# EAGLE board FPGA_ADC_USB_Board (EAGLE 6.5.0)
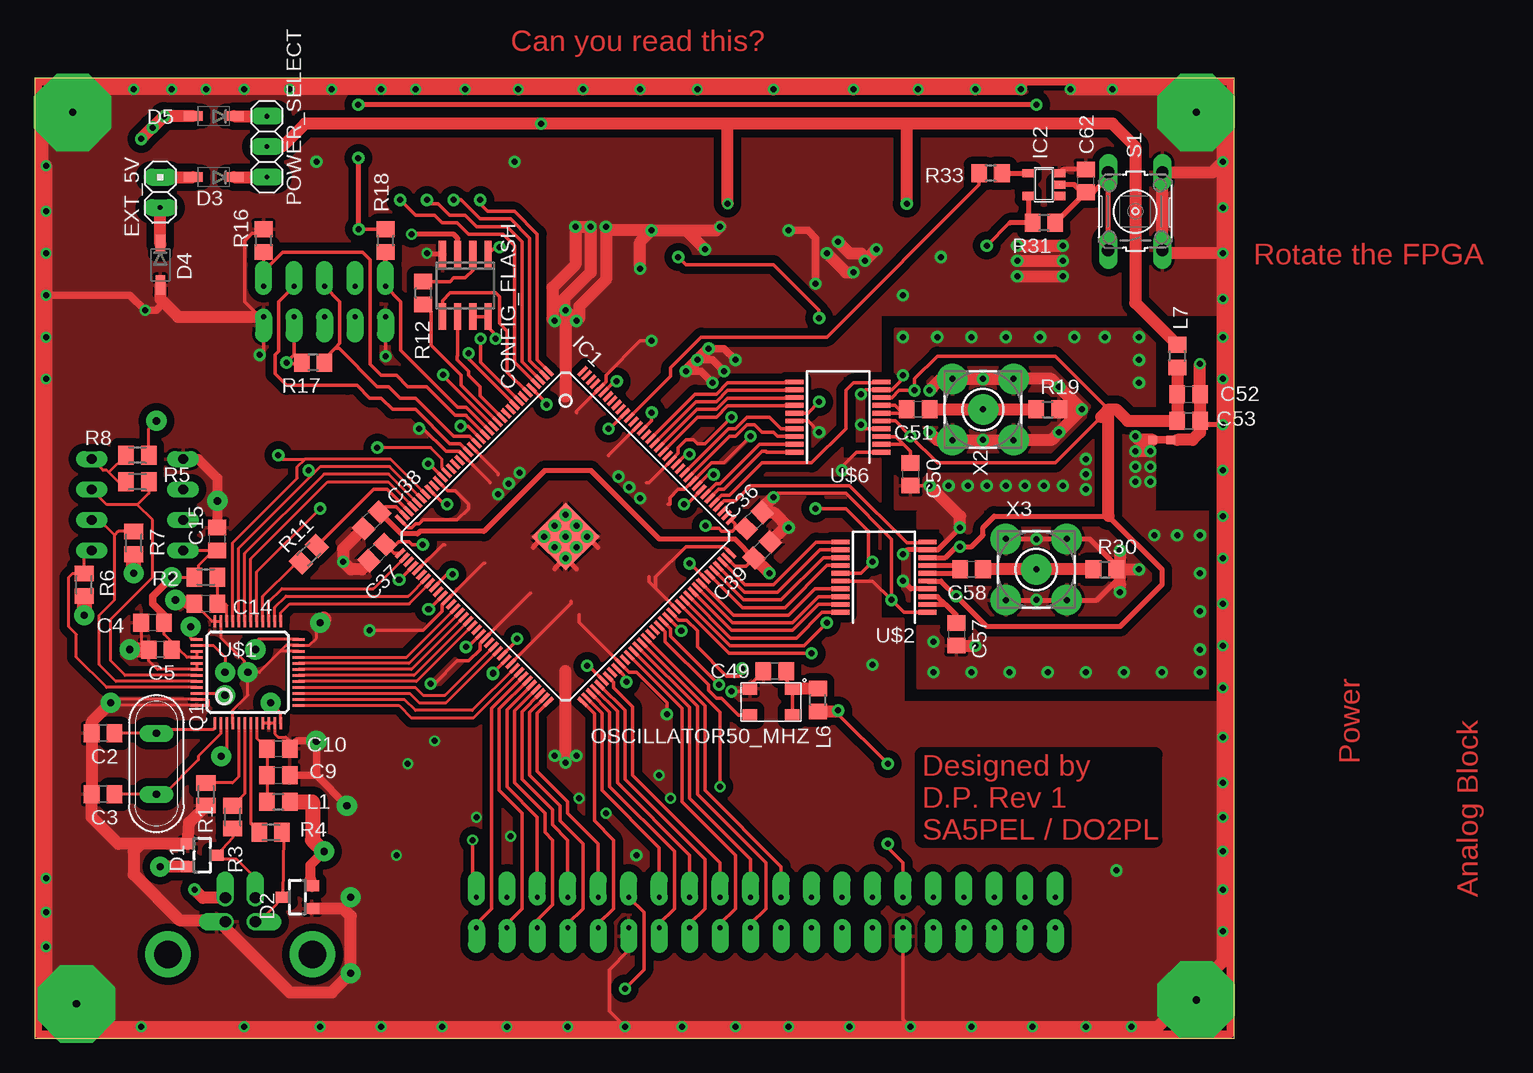
[diagram p5: board, top side]
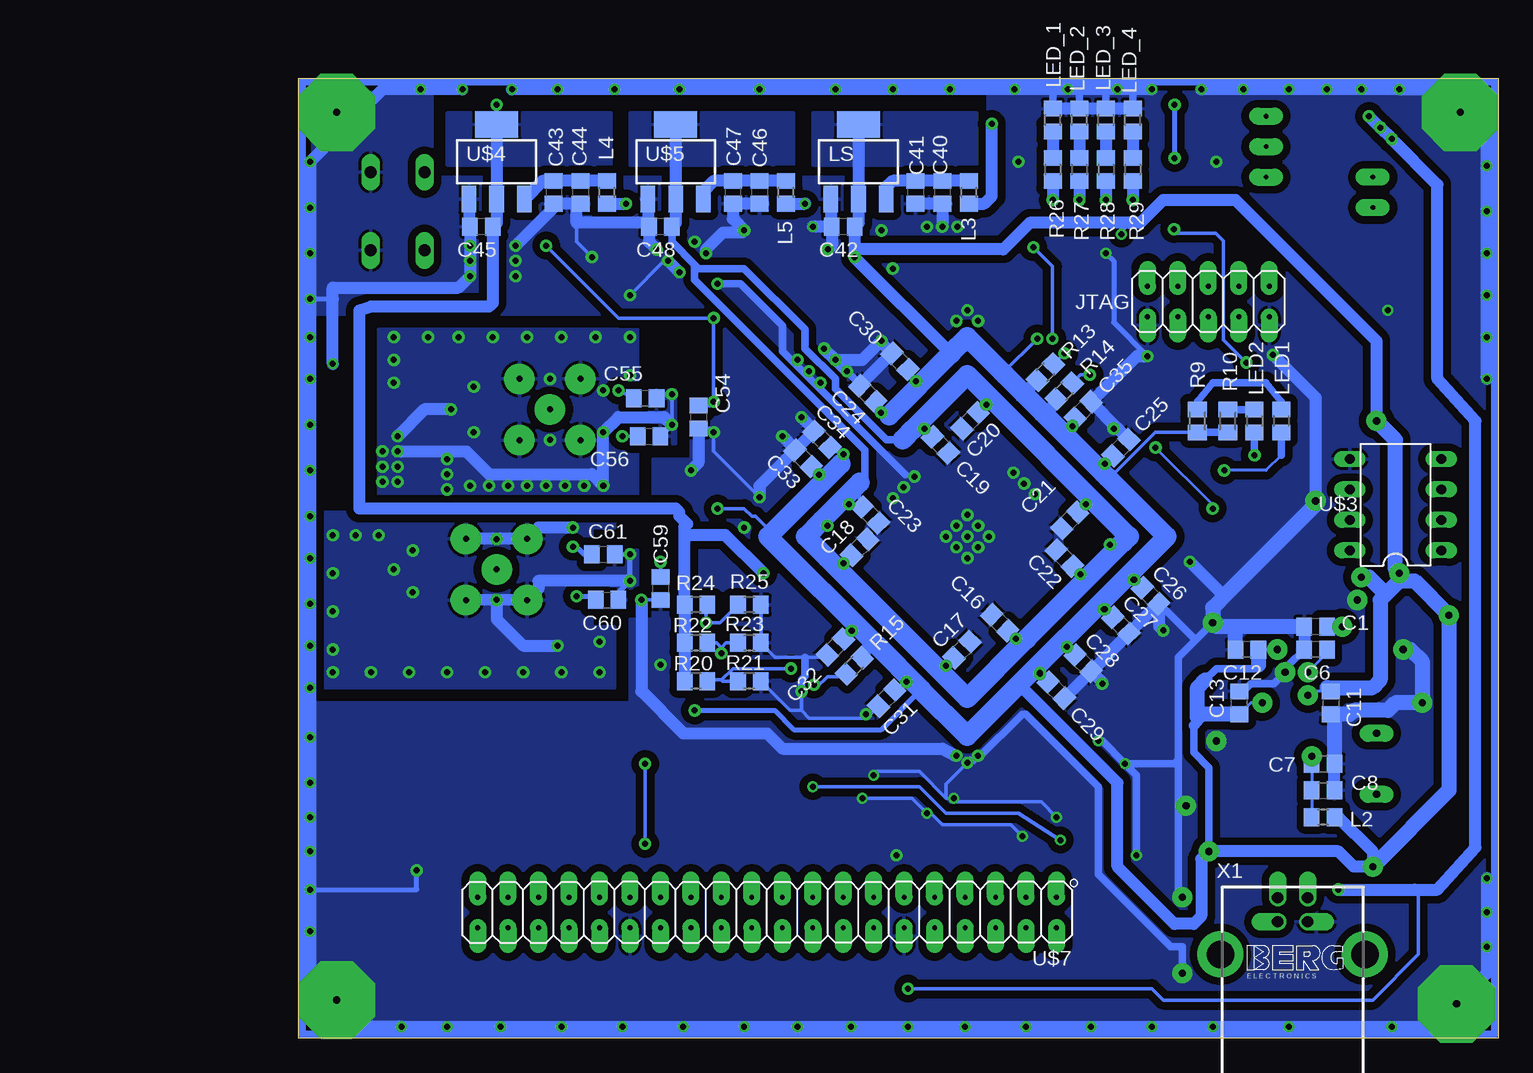
[diagram p6: board, bottom side, seen from below]

Size 100 x 80 mm. Coordinates in mm from the lower left corner, seen from the top.
Outline: 0,0 100,0 100,80 0,80 0,0
Copper layers (1*16): Top 0.035mm / dielectric 1.5mm / Bottom 0.035mm
Design rules "FinalizeAreaFill": minimum track width 12mil, minimum drill 1.4mm, track to track 25mil, track to pad 25mil, pad to pad 8mil, via to via 8mil, smd to smd 8mil, copper to edge 40mil, drill to drill 8mil, minimum pad ring 10mil, minimum via ring 8mil, stop-mask expansion 4mil, vias tented up to drill 0mil, thermal gap 10mil

## Footprints (pad centres in the part's own frame; a part is rotated, then mirrored left to right if it is on the bottom)
C0805 = smd 1.3 x 1.5: 1 -0.95,0; 2 0.95,0
SO08 = smd 0.6 x 2.2: 1 -1.905,-2.6; 2 -0.635,-2.6; 3 0.635,-2.6; 4 1.905,-2.6; 5 1.905,2.6; 6 0.635,2.6; 7 -0.635,2.6; 8 -1.905,2.6
SOT23 = smd 0.9 x 1.2: 1 -0.95,-1.2; 2 0.95,-1.2; 3 0,1.2
SOD123 = smd 1.6 x 0.8: 1 -1.7,0; 2 1.7,0
1X02 = drill 0.4 pad 1.422 long: 1 -1.27,0; 2 1.27,0
EQFP144 = smd 1 x 0.3: 1 -10.75,8.75; 2 -10.75,8.25; 3 -10.75,7.75; 4 -10.75,7.25; 5 -10.75,6.75; 6 -10.75,6.25; 7 -10.75,5.75; 8 -10.75,5.25; 9 -10.75,4.75; 10 -10.75,4.25; 11 -10.75,3.75; 12 -10.75,3.25; 13 -10.75,2.75; 14 -10.75,2.25; 15 -10.75,1.75; 16 -10.75,1.25; 17 -10.75,0.75; 18 -10.75,0.25; 19 -10.75,-0.25; 20 -10.75,-0.75; 21 -10.75,-1.25; 22 -10.75,-1.75; 23 -10.75,-2.25; 24 -10.75,-2.75; 25 -10.75,-3.25; 26 -10.75,-3.75; 27 -10.75,-4.25; 28 -10.75,-4.75; 29 -10.75,-5.25; 30 -10.75,-5.75; 31 -10.75,-6.25; 32 -10.75,-6.75; 33 -10.75,-7.25; 34 -10.75,-7.75; 35 -10.75,-8.25; 36 -10.75,-8.75; 73 10.75,-8.75; 74 10.75,-8.25; 75 10.75,-7.75; 76 10.75,-7.25; 77 10.75,-6.75; 78 10.75,-6.25; 79 10.75,-5.75; 80 10.75,-5.25; 81 10.75,-4.75; 82 10.75,-4.25; 83 10.75,-3.75; 84 10.75,-3.25; 85 10.75,-2.75; 86 10.75,-2.25; 87 10.75,-1.75; 88 10.75,-1.25; 89 10.75,-0.75; 90 10.75,-0.25; 91 10.75,0.25; 92 10.75,0.75; 93 10.75,1.25; 94 10.75,1.75; 95 10.75,2.25; 96 10.75,2.75; 97 10.75,3.25; 98 10.75,3.75; 99 10.75,4.25; 100 10.75,4.75; 101 10.75,5.25; 102 10.75,5.75; 103 10.75,6.25; 104 10.75,6.75; 105 10.75,7.25; 106 10.75,7.75; 107 10.75,8.25; 108 10.75,8.75 | smd 0.3 x 1: 37 -8.75,-10.75; 38 -8.25,-10.75; 39 -7.75,-10.75; 40 -7.25,-10.75; 41 -6.75,-10.75; 42 -6.25,-10.75; 43 -5.75,-10.75; 44 -5.25,-10.75; 45 -4.75,-10.75; 46 -4.25,-10.75; 47 -3.75,-10.75; 48 -3.25,-10.75; 49 -2.75,-10.75; 50 -2.25,-10.75; 51 -1.75,-10.75; 52 -1.25,-10.75; 53 -0.75,-10.75; 54 -0.25,-10.75; 55 0.25,-10.75; 56 0.75,-10.75; 57 1.25,-10.75; 58 1.75,-10.75; 59 2.25,-10.75; 60 2.75,-10.75; 61 3.25,-10.75; 62 3.75,-10.75; 63 4.25,-10.75; 64 4.75,-10.75; 65 5.25,-10.75; 66 5.75,-10.75; 67 6.25,-10.75; 68 6.75,-10.75; 69 7.25,-10.75; 70 7.75,-10.75; 71 8.25,-10.75; 72 8.75,-10.75; 109 8.75,10.75; 110 8.25,10.75; 111 7.75,10.75; 112 7.25,10.75; 113 6.75,10.75; 114 6.25,10.75; 115 5.75,10.75; 116 5.25,10.75; 117 4.75,10.75; 118 4.25,10.75; 119 3.75,10.75; 120 3.25,10.75; 121 2.75,10.75; 122 2.25,10.75; 123 1.75,10.75; 124 1.25,10.75; 125 0.75,10.75; 126 0.25,10.75; 127 -0.25,10.75; 128 -0.75,10.75; 129 -1.25,10.75; 130 -1.75,10.75; 131 -2.25,10.75; 132 -2.75,10.75; 133 -3.25,10.75; 134 -3.75,10.75; 135 -4.25,10.75; 136 -4.75,10.75; 137 -5.25,10.75; 138 -5.75,10.75; 139 -6.25,10.75; 140 -6.75,10.75; 141 -7.25,10.75; 142 -7.75,10.75; 143 -8.25,10.75; 144 -8.75,10.75 | smd 4 x 4: E 0,0
SOT23-5 = smd 0.69 x 0.99: 1 -0.95,-1.29; 2 0,-1.29; 3 0.95,-1.29; 4 0.95,1.3; 5 -0.95,1.3
2X05 = drill 0.4 pad 1.422 offset: 1 -5.08,-1.27; 2 -5.08,1.27; 3 -2.54,-1.27; 4 -2.54,1.27; 5 0,-1.27; 6 0,1.27; 7 2.54,-1.27; 8 2.54,1.27; 9 5.08,-1.27; 10 5.08,1.27
R0805 = smd 1.3 x 1.5: 1 -0.95,0; 2 0.95,0
SOT223 = smd 1.219 x 2.235: 1 -2.311,-3.099; 2 0,-3.099; 3 2.311,-3.099 | smd 3.6 x 2.2: 4 0,3.099
OSZI_5X3.2 = smd 1.2 x 1: 1 -1.77,-1.1; 2 1.77,-1.1; 3 1.77,1.1; 4 -1.77,1.1
1X03 = drill 0.4 pad 1.422 long: 1 -2.54,0; 2 0,0; 3 2.54,0
QS = drill 0.61 pad 1.422 long: 1 -2.54,0; 2 2.54,0
M0805 = smd 1.3 x 1.6: 1 -0.95,0; 2 0.95,0
B3F-10XX = drill 1.016 long: 1 -3.251,2.261; 2 3.251,2.261; 3 -3.251,-2.261; 4 3.251,-2.261
LQFP48 = smd 0.2 x 1: 1 -2.75,-4.25; 2 -2.25,-4.25; 3 -1.75,-4.25; 4 -1.25,-4.25; 5 -0.75,-4.25; 6 -0.25,-4.25; 7 0.25,-4.25; 8 0.75,-4.25; 9 1.25,-4.25; 10 1.75,-4.25; 11 2.25,-4.25; 12 2.75,-4.25; 25 2.75,4.25; 26 2.25,4.25; 27 1.75,4.25; 28 1.25,4.25; 29 0.75,4.25; 30 0.25,4.25; 31 -0.25,4.25; 32 -0.75,4.25; 33 -1.25,4.25; 34 -1.75,4.25; 35 -2.25,4.25; 36 -2.75,4.25 | smd 1 x 0.2: 13 4.25,-2.75; 14 4.25,-2.25; 15 4.25,-1.75; 16 4.25,-1.25; 17 4.25,-0.75; 18 4.25,-0.25; 19 4.25,0.25; 20 4.25,0.75; 21 4.25,1.25; 22 4.25,1.75; 23 4.25,2.25; 24 4.25,2.75; 37 -4.25,2.75; 38 -4.25,2.25; 39 -4.25,1.75; 40 -4.25,1.25; 41 -4.25,0.75; 42 -4.25,0.25; 43 -4.25,-0.25; 44 -4.25,-0.75; 45 -4.25,-1.25; 46 -4.25,-1.75; 47 -4.25,-2.25; 48 -4.25,-2.75
SSOP20 = smd 0.4 x 1.5: 1 -2.925,-3.625; 2 -2.275,-3.625; 3 -1.625,-3.625; 4 -0.975,-3.625; 5 -0.325,-3.625; 6 0.325,-3.625; 7 0.975,-3.625; 8 1.625,-3.625; 9 2.275,-3.625; 10 2.925,-3.625; 11 2.925,3.625; 12 2.275,3.625; 13 1.625,3.625; 14 0.975,3.625; 15 0.325,3.625; 16 -0.325,3.625; 17 -0.975,3.625; 18 -1.625,3.625; 19 -2.275,3.625; 20 -2.925,3.625
DIL-08 = drill 0.813 long: 1 -3.81,-3.81; 2 -1.27,-3.81; 3 1.27,-3.81; 4 3.81,-3.81; 5 3.81,3.81; 6 1.27,3.81; 7 -1.27,3.81; 8 -3.81,3.81
2X20 = drill 0.4 pad 1.422 offset: 1 -24.13,-1.27; 2 -24.13,1.27; 3 -21.59,-1.27; 4 -21.59,1.27; 5 -19.05,-1.27; 6 -19.05,1.27; 7 -16.51,-1.27; 8 -16.51,1.27; 9 -13.97,-1.27; 10 -13.97,1.27; 11 -11.43,-1.27; 12 -11.43,1.27; 13 -8.89,-1.27; 14 -8.89,1.27; 15 -6.35,-1.27; 16 -6.35,1.27; 17 -3.81,-1.27; 18 -3.81,1.27; 19 -1.27,-1.27; 20 -1.27,1.27; 21 1.27,-1.27; 22 1.27,1.27; 23 3.81,-1.27; 24 3.81,1.27; 25 6.35,-1.27; 26 6.35,1.27; 27 8.89,-1.27; 28 8.89,1.27; 29 11.43,-1.27; 30 11.43,1.27; 31 13.97,-1.27; 32 13.97,1.27; 33 16.51,-1.27; 34 16.51,1.27; 35 19.05,-1.27; 36 19.05,1.27; 37 21.59,-1.27; 38 21.59,1.27; 39 24.13,-1.27; 40 24.13,1.27
NET-TIE = smd 0.711 x 0.711: NET1 -0.77,0; NET2 0.73,0
PN61729-S = drill 0.95 offset: 1 1.25,4.71; 2 -1.25,4.71; 3 -1.25,2.71; 4 1.25,2.71 | drill 2.3 pad 3.81: S1 -6.02,0; S2 6.02,0
BU-SMA-V = drill 0.5 pad 2.54: 1 0,0; 2 -2.55,2.55; 3 2.55,2.55; 4 2.55,-2.55; 5 -2.55,-2.55

## Placement (x,y rotation side)
C1  0.1u  [C0805]  15.24,34.29 180 bottom
C2  27p  [C0805]  5.71,25.4 180 top
C3  27p  [C0805]  5.71,20.32 180 top
C4  47u  [C0805]  9.84,34.61 180 top
C5  0.1u  [C0805]  10.48,32.38 180 top
C6  0.1  [C0805]  15.24,32.38 180 bottom
C7  0.1u  [C0805]  14.61,22.86 0 bottom
C8  47u  [C0805]  14.61,20.64 0 bottom
C9  0.1u  [C0805]  20.32,21.91 0 top
C10  47u  [C0805]  20.32,24.13 0 top
C11  0.1u  [C0805]  13.97,27.94 270 bottom
C12  0.1u  [C0805]  20.95,32.38 180 bottom
C13  0.1u  [C0805]  21.59,27.94 90 bottom
C14  10n  [C0805]  14.29,36.2 180 top
C15  0.1  [C0805]  15.24,41.59 90 top
C16  100n  [C0805]  41.57,34.62 135 bottom
C17  100n  [C0805]  44.71,32.37 45 bottom
C18  100n  [C0805]  53.24,40.9 45 bottom
C19  100n  [C0805]  46.51,49.43 315 bottom
C20  100n  [C0805]  44.04,51.45 225 bottom
C21  100n  [C0805]  35.73,43.15 225 bottom
C22  100n  [C0805]  36.18,40.01 135 bottom
C23  100n  [C0805]  52.35,43.6 315 bottom
C24  100n  [C0805]  52.57,53.7 135 bottom
C25  100n  [C0805]  31.47,49.21 45 bottom
C26  100n  [C0805]  29,36.86 315 bottom
C27  100n  [C0805]  31.47,34.39 315 bottom
C28  100n  [C0805]  34.61,31.25 315 bottom
C29  100n  [C0805]  36.86,29 315 bottom
C30  100n  [C0805]  49.88,56.39 135 bottom
C31  100n  [C0805]  51,28.33 225 bottom
C32  100n  [C0805]  55.26,32.6 225 bottom
C33  100n  [C0805]  57.96,48.31 135 bottom
C34  100n  [C0805]  56.39,49.88 135 bottom
C35  100n  [C0805]  34.61,52.35 45 bottom
C36  100n  [C0805]  59.98,43.15 45 top
C37  100n  [C0805]  28.55,40.45 225 top
C38  100n  [C0805]  28.1,43.15 225 top
C39  100n  [C0805]  60.65,40.68 45 top
C40  10u  [C0805]  46.35,70.48 270 bottom
C41  100n  [C0805]  48.58,70.48 270 bottom
C42  10u  [C0805]  54.61,67.63 180 bottom
C43  10u  [C0805]  78.74,70.48 270 bottom
C44  100n  [C0805]  76.52,70.48 270 bottom
C45  10u  [C0805]  84.77,67.63 180 bottom
C46  10u  [C0805]  61.59,70.48 270 bottom
C47  100n  [C0805]  63.82,70.48 270 bottom
C48  10u  [C0805]  69.85,67.63 180 bottom
C49  100n  [C0805]  61.71,30.57 180 top
C50  100nF  [C0805]  73.03,46.99 270 top
C51  100nF  [C0805]  73.66,52.39 180 top
C52  10u  [C0805]  96.2,53.66 0 top
C53  100n  [C0805]  96.2,51.44 0 top
C54  100n  [C0805]  66.67,51.75 270 bottom
C55  100n  [C0805]  71.12,53.34 0 bottom
C56  100n  [C0805]  70.8,50.16 0 bottom
C57  100nF  [C0805]  76.83,33.66 270 top
C58  100nF  [C0805]  78.11,39.05 180 top
C59  100n  [C0805]  69.85,37.47 270 bottom
C60  100n  [C0805]  74.3,36.51 0 bottom
C61  100n  [C0805]  74.61,40.32 0 bottom
C62  1u  [C0805]  87.63,71.44 90 top
CONFIG_FLASH  EPCS-FALSH  [SO08]  35.9,62.73 180 top
D1  [SOT23]  13.97,15.24 270 top
D2  [SOT23]  21.91,11.75 90 top
D3  PMEG2010AEH  [SOD123]  14.92,71.75 180 top
D4  PMEG2010AEH  [SOD123]  10.48,64.45 270 top
D5  PMEG2010AEH  [SOD123]  14.92,76.83 180 top
EXT_5V  [1X02]  10.48,70.48 270 top
IC1  EP3C5E144-V2  [EQFP144]  44.26,41.8 315 top
IC2  74LVC1G07DBV  [SOT23-5]  84.14,71.12 90 top
JTAG  [2X05]  24.18,61.38 180 bottom
L1  600R/0.5A  [R0805]  20.32,19.68 180 top
L2  600R/0.5A  [R0805]  14.61,18.41 180 bottom
L3  MH2029-300Y  [R0805]  44.13,70.48 90 bottom
L4  MH2029-300Y  [R0805]  74.3,70.48 90 bottom
L5  MH2029-300Y  [R0805]  59.37,70.48 90 bottom
L6  MH2029-300Y  [R0805]  65.29,28.17 90 top
L7  MH2029-300Y  [R0805]  95.25,56.83 270 top
LED1  Yellow  [R0805]  18.1,51.44 270 bottom
LED2  Green  [R0805]  20.32,51.44 270 bottom
LED_1  [R0805]  37.15,76.52 90 bottom
LED_2  [R0805]  34.92,76.52 90 bottom
LED_3  [R0805]  32.7,76.52 90 bottom
LED_4  [R0805]  30.48,76.52 90 bottom
LS  3.3V  [SOT223]  53.34,73.03 0 bottom
OSCILLATOR50_MHZ  636L3I050M00000  [OSZI_5X3.2]  61.39,28.03 180 top
POWER_SELECT  [1X03]  19.37,74.3 90 top
Q1  12MHz  [QS]  10.16,22.86 270 top
R1  12k/1%  [M0805]  14.29,20.32 90 top
R2  10k  [M0805]  14.29,38.42 180 top
R3  0  [M0805]  16.51,18.41 270 top
R4  0  [M0805]  19.68,17.14 0 top
R5  2k  [M0805]  8.57,46.35 0 top
R6  10k  [M0805]  4.13,37.78 270 top
R7  10k  [M0805]  8.26,41.27 270 top
R8  10k  [M0805]  8.57,48.58 0 top
R9  470  [M0805]  25.08,51.44 270 bottom
R10  470  [M0805]  22.54,51.44 270 bottom
R11  27  [M0805]  22.86,40.32 45 top
R12  24.9  [R0805]  32.41,62.1 90 top
R13  10k  [R0805]  37.75,55.5 225 bottom
R14  10k  [R0805]  36.18,53.92 225 bottom
R15  10k  [R0805]  53.69,31.02 45 bottom
R16  1k  [R0805]  19.1,66.46 90 top
R17  10k  [R0805]  23.22,56.3 180 top
R18  10k  [R0805]  29.26,66.46 90 top
R19  50Ohm  [R0805]  84.45,52.39 0 top
R20  0  [R0805]  66.88,29.76 180 bottom
R21  0  [R0805]  62.43,29.76 180 bottom
R22  0  [R0805]  66.88,32.93 180 bottom
R23  0  [R0805]  62.43,32.93 180 bottom
R24  0  [R0805]  66.88,36.11 180 bottom
R25  0  [R0805]  62.43,36.11 180 bottom
R26  330  [R0805]  37.15,72.39 270 bottom
R27  330  [R0805]  34.92,72.39 270 bottom
R28  330  [R0805]  32.7,72.39 270 bottom
R29  330  [R0805]  30.48,72.39 270 bottom
R30  50Ohm  [R0805]  89.22,39.05 0 top
R31  100k  [R0805]  84.14,67.94 180 top
R33  120  [R0805]  79.69,72.07 180 top
S1  [B3F-10XX]  91.76,68.9 90 top
U$1  FT232H  [LQFP48]  17.78,30.48 0 top
U$2  AD9057  [SSOP20]  70.8,38.42 90 top
U$3  93LC56  [DIL-08]  8.57,44.45 90 bottom
U$4  2.5V  [SOT223]  83.5,73.03 0 bottom
U$5  1.2V  [SOT223]  68.58,73.03 0 bottom
U$6  AD9057  [SSOP20]  66.99,51.75 90 top
U$7  FPGA_GPIO_DE0  [2X20]  60.96,10.48 180 bottom
U$8  NET_TIE  [NET-TIE]  93.98,49.85 0 top
X1  PN61729-S  [PN61729-S]  17.14,6.99 0 bottom
X2  BU-SMA-V  [BU-SMA-V]  79.06,52.39 90 top
X3  BU-SMA-V  [BU-SMA-V]  83.5,39.05 0 top

## Tracks (layer width: path | path; a pad name or v marks a point on that pad's centre or on a via)
1.2V  (via drill 0.5 pad 1.02)
  Top 0.305: IC1.45 34.4,38.66 v34.84,38.66 | IC1.61 40.22,33.16 v40.22,33.27 | IC1.78 46.2,31.02 v46.06,31.02 | IC1.102 54.64,39.56 v54.59,39.56 | IC1.116 54.38,44.49 v54.14,44.49 | IC1.134 47.94,50.78 v47.86,50.78 | IC1.5 42.69,52.92 v42.69,52.8 | IC1.29 34.15,44.49 v34.39,44.49 | IC1.37 29.96,40.39 C37.1 30.12,41.13 30.34,41.35 31.24,41.35 31.47,41.13 v32.37,41.13 | v55.94,42.7 56.16,42.48 57.06,42.48 57.28,42.25 58.18,42.25 58.41,42.48 | 58.41,42.48 C36.1 | 58.41,42.48 58.41,42.86 IC1.109
  Bottom 0.305: C22.1 v34.84,38.66 v32.37,41.13 32.14,41.35 | C21.1 v34.39,44.49 31.69,41.8 32.14,41.35 | C20.1 v42.69,52.8 42.69,53.7 44.26,55.27 | C19.1 v47.86,50.78 48.75,50.78 | C23.1 53.24,44.49 | 53.24,44.49 v54.14,44.49 | C17.1 v46.06,31.02 46.06,30.13 44.26,28.33 | v55.94,42.7 56.39,43.15 | 53.24,44.49 53.24,46.29 | 32.14,41.35 31.24,41.35 | C16.1 v40.22,33.27 39.33,33.27 | C18.1 v54.59,39.56 55.04,40.01 55.94,40.01
  Bottom 0.61: 55.24,54.13 51,49.88 49.65,49.88 | 53.24,46.29 52.8,46.74 52.8,48.98 66.99,63.18 66.99,64.14 | 66.67,64.14 66.99,64.45 | 66.99,64.45 68.9,66.36 C48.1 | 66.99,64.14 66.99,64.45 | 55.24,54.29 55.24,54.93 57.78,57.47 57.78,59.05 62.87,64.14 66.99,64.14
  Bottom 1.016: U$5.4 U$5.2 68.58,67.95 C48.1
  Bottom 1.676: 53.24,46.29 56.39,43.15 57.73,41.8 55.94,40.01 44.26,28.33 39.33,33.27 31.24,41.35 30.79,41.8 44.26,55.27 48.75,50.78 49.65,49.88
  pour Bottom: 58.74,77.15 58.74,72.71 72.39,72.71 72.39,77.15
2.5V  (via drill 0.5 pad 1.02)
  Top 0.305: IC1.107 58.4,39.33 59.31,39.33 C39.1 | IC1.35 30.13,44.27 29.22,44.27 C38.1 | JTAG.4 21.64,56.94 | 21.64,56.94 R17.2 22.17,56.2 20.95,56.2 | 21.64,56.94 21.64,56.93 v21,56.3 | v27.03,67.41 R18.2
  Top 0.406: C39.1 58.41,41.58 52.09,41.58 46.35,47.31 42.55,47.31 37.47,42.23 32.16,42.23 32.14,42.25 31.92,42.03 30.57,42.03 C38.1 | v83.5,77.79 v26.99,77.79 | v26.99,73.34 26.99,67.41 v27.03,67.41
  Top 1.016: v61.28,38.73 61.25,38.73 C39.1
  Bottom 0.305: v21,56.3 22.91,58.2 22.91,66.46 23.54,67.09 26.71,67.09 v27.03,67.41
  Bottom 0.406: v26.99,77.79 v26.99,73.34 | U$4.4 v83.5,77.79
  Bottom 1.016: R24.2 | R24.2 R22.2 R20.2 | U$4.4 U$4.2 83.5,67.95 C45.1 83.82,61.28 84.14,60.96 93.98,60.96 94.93,60.64 94.93,44.13 68.58,44.13 68.26,43.81 68.26,43.5 67.63,42.86 arc-90 67.83,42.66 67.83,41.59 | R24.2 67.83,41.59 | v61.28,38.73 64.45,41.91 67.51,41.91 67.83,41.59
  pour Bottom: 73.98,77.15 73.98,72.71 87.63,72.71 87.63,77.15
3.3V  (via drill 0.5 pad 0.3, 0.5 pad 1.02, 0.6 pad 1.68)
  Top 0.254: U$1.39 U$1.40 12.72,31.73 12.06,32.38 C5.1 | U$1.12 20.53,27.09 v19.68,27.94 | U$1.24 18.62,33.23 18.41,33.02 v18.41,32.38 | U$1.46 15.72,28.73 v15.88,28.57 | 11.45,32.37 C5.1 | C5.1 11.43,33.02 10.79,33.66 C4.1 | U$3.8 C15.1 14.93,40.64 13.65,39.37 13.65,38.73 R2.2 v11.43,38.42 | R8.2 9.52,50.8 v10.16,51.44
  Top 0.305: IC1.17 36.12,51.01 v35.51,51.01 | IC1.40 v30.42,38.21 v30.34,38.21 | IC1.47 v32.9,35.74 v32.81,35.74 | v35.96,32.6 36.12,32.6 IC1.56 36.85,33.33 | IC1.62 v38.2,30.44 v38.2,30.35 | v49.34,29.68 49.65,29.7 IC1.81 49,30.35 | IC1.93 v53.89,33.94 v53.92,33.94 | IC1.117 56.15,46.97 v56.61,46.97 | IC1.122 54.59,48.95 v54.59,48.67 | IC1.139 48.53,54.91 v48.53,54.73 | IC1.130 51.45,51.46 v51.45,52.13 | CONFIG_FLASH.7 CONFIG_FLASH.8 37.81,59.24 38.44,58.6 v38.44,58.29 | IC1.26 32.9,47.86 v32.81,47.86 | U$6.15 64.46,52.08 v65.41,53.02 | v65.41,60.01 65.41,60.64 61.59,64.45 54.29,64.45 54.29,64.46 v53.66,65.09 | U$2.15 68.91,38.74 v69.85,39.69 69.53,40 69.53,42.23 67.63,44.13 v65.09,44.13 | 66.91,27.22 66.91,27.07 v71.12,22.86 | v71.12,16.19 71.12,15.88 72.39,14.61 U$7.29 | v79.38,66.04 81.28,67.94
  Top 0.406: CONFIG_FLASH.3 35.27,66.65 34.92,66.99 v31.43,66.99 | IC2.5 82.84,68.61 R31.2 81.28,67.94
  Top 0.61: C4.1 10.79,35.24 9.84,36.2 9.84,36.83 v11.43,38.42
  Top 0.813: 23.01,13.16 23.01,14.44 v24.13,15.56
  Top 1.016: D2.2 23.01,13.16 | D1.2 v10.48,14.29 | L6.1 66.91,27.22 v66.99,27.3
  Top 1.27: R6.2 v4.13,35.24 | v8.26,38.73 R7.2 | L1.1 23.18,19.68 23.18,16.51 v24.13,15.56
  Bottom 0.254: v19.68,27.94 20.64,27.94 C13.1 | 14.29,29.21 C11.1 15.56,28.89 v15.88,28.57 | v18.41,32.38 C12.1
  Bottom 0.305: C31.1 v49.34,29.68 49.65,29.71 52.56,32.61 v53.89,33.94 | C32.1 v53.92,33.94 | C33.1 v56.61,46.97 55.71,46.97 54.82,47.86 54.59,48.09 v54.59,48.67 55.49,48.98 C34.1 | C24.1 v51.45,52.13 | C30.1 v48.53,54.73 v51.45,52.13 | 50.77,51.9 v51.45,52.13 | C25.1 v32.81,47.86 32.93,47.75 32.93,47.08 | C35.1 v35.51,51.01 | C26.1 v30.34,38.21 | C27.1 v32.81,35.74 32.81,35.81 v30.42,38.21 | C28.1 v35.96,32.6 | C29.1 v38.2,30.35 | 35.96,50.92 v35.51,51.01 | v32.9,35.74 35.96,32.68 v35.96,32.6 | v35.96,32.6 36.04,32.6 v38.2,30.44 38.65,30.88 40.01,29.53 43.5,26.04 | v38.44,58.29 41.24,55.49 41.34,55.49 | C54.1 65.72,52.7 v65.41,53.02 v65.41,60.01 73.34,60.01 v79.38,66.04 | R9.2 28.57,50.48 32.3,46.76 32.61,46.76 | C59.1 v69.85,39.69 | v65.09,44.13 62.87,44.13 62.23,43.5 61.91,43.5 60.55,42.13 | 37.53,52.13 37.53,51.82 35.88,50.16 35.88,50.64 v35.51,51.01 | v71.12,22.86 v71.12,16.19
  Bottom 0.406: v31.43,66.99 31.43,67.31 30.8,67.94 | v66.99,27.3 60.33,27.3 58.74,25.72 51.44,25.72 48.11,29.04
  Bottom 0.61: 24.45,29.84 23.5,30.8 20.32,30.8 20,31.11 | v24.13,15.56 24.13,22.54 25.4,23.81 25.4,26.04 | R9.2 R10.2
  Bottom 0.813: 25.08,26.67 25.08,26.36 25.4,26.04
  Bottom 1.016: L2.1 13.34,18.41 10.48,15.56 v10.48,14.29 12.06,14.29 13.34,15.56 v24.13,15.56 24.77,14.92 24.77,10.16 25.4,9.53 26.99,9.53 31.75,14.29 31.75,21.27 40.01,29.53 | 51.9,32.82 52.35,32.82 52.56,32.61 R15.2 | R14.2 37.53,52.13 37.98,52.13 | R13.2 39.55,53.7 | LS.4 LS.2 53.34,67.95 C42.1 53.66,65.72 | 53.66,65.72 v53.66,65.09 45.62,57.05 | v10.16,51.44 10.16,58.1 21.91,69.85 27.94,69.85 29.84,67.94 30.8,67.94 39.05,67.94 41.27,65.72 53.66,65.72
  Bottom 1.27: C12.1 20,31.11 | 24.45,29.84 25.08,29.21 25.08,26.99 | C13.1 25.08,26.99 | 14.29,29.21 10.48,29.21 9.84,29.84 9.84,36.51 9.37,36.99 | 8.26,38.1 v8.26,38.73 8.57,39.05 8.57,49.85 v10.16,51.44 | 8.26,38.1 9.37,36.99 | 8.26,38.1 6.99,38.1 v4.13,35.24 4.13,20.64 v10.48,14.29 | v11.43,38.42 10.79,38.42 9.37,36.99 | 25.08,26.67 25.08,26.99
  Bottom 1.676: 50.77,51.9 45.62,57.05 44.26,58.41 41.34,55.49 41.12,55.27 39.55,53.7 37.98,52.13 32.93,47.08 32.61,46.76 27.65,41.8 44.26,25.19 48.11,29.04 51.9,32.82 60.88,41.8 60.55,42.13 54.82,47.86
  pour Bottom: 43.5,77.15 43.5,72.71 57.15,72.71 57.15,77.15
5V  (via drill 0.5 pad 0.61, 0.5 pad 1.02)
  Top 1.016: v57.78,69.53 57.78,76.2 | 57.78,76.2 v42.23,76.2 22.54,76.2 20.64,74.3 POWER_SELECT.2 | v72.71,69.53 72.71,76.2 | 72.71,76.2 57.78,76.2 | 72.71,76.2 89.85,76.2 91.76,74.3 91.76,61.27 L7.1
  Bottom 1.016: L3.1 42.86,69.53 42.23,70.17 v42.23,76.2 | L5.1 v57.78,69.53 | L4.1 v72.71,69.53
5V_ANALOG  (via drill 0.5 pad 1.02)
  Top 0.305: U$6.5 71.76,51.43 v73.03,50.16 75.25,47.94 85.09,47.94 88.9,51.75 | U$6.8 71.47,53.38 72.07,53.98 v73.34,53.98 73.34,54.93 75.25,56.83 85.09,56.83 89.38,52.55 89.38,52.23
  Top 0.406: U$2.5 75.57,38.09 v76.83,36.83 79.38,34.29 90.49,34.29 93.98,37.78 93.98,39.05 89.53,43.5 80.01,43.5 79.06,42.55 79.06,41.91 78.11,40.96 v77.15,40.96 76.83,40.96 75.92,40.04 U$2.8
  Top 1.016: L7.2 C52.1 C53.1 91.12,51.44 90.17,52.39 89.85,52.39 | 88.9,51.75 89.38,52.23 89.53,52.39 89.85,52.39 | 89.53,43.5 89.53,52.07 89.85,52.39
  Bottom 0.305: v73.03,50.16 C56.1 | v73.34,53.98 C55.1
  Bottom 0.406: C61.1 76.2,40.32 76.68,40.8 76.99,40.8 v77.15,40.96 | v76.83,36.83 75.56,36.83 C60.1
5V_EXT
  Top 1.016: D3.1 POWER_SELECT.1
5V_USB  (via drill 0.5 pad 1.02)
  Top 0.305: U$7.11 50.8,10.48 50.8,5.71 v49.21,4.13
  Top 1.016: X1.1 14.02,11.7 v13.34,12.38 | D5.2 v10.79,76.83 v8.89,74.93
  Bottom 0.305: v49.21,4.13 28.89,4.13 27.94,3.17 10.48,3.17 6.67,6.99 6.67,12.06 6.99,12.38
  Bottom 1.016: v13.34,12.38 6.99,12.38 5.08,12.38 1.91,15.88 1.91,51.44 5.08,54.93 5.08,71.12 v8.89,74.93 v9.84,75.88 v10.79,76.83
ACBUS0
  Top 0.254: U$1.21 31.01,31.73 IC1.50
ACBUS1
  Top 0.254: 20.53,35.13 U$1.25 20.53,35.45 21.27,36.2 31.23,36.2 IC1.44
ACBUS2
  Top 0.254: U$1.26 20.03,35.91 20.95,36.83 31.16,36.83 IC1.43
ACBUS3
  Top 0.254: U$1.27 19.53,36.36 20.64,37.47 28.26,37.47 IC1.38
ACBUS4
  Top 0.305: IC1.34 29.39,45.72 28.26,45.72 R11.2 23.5,40.96
  Top 0.406: 23.5,40.96 23.53,40.96 R11.2
ACBUS6
  Top 0.254: U$1.30 18.03,39.94 24.45,46.35 29.46,46.35 IC1.33
ACBUS7
  Top 0.254: U$1.31 17.53,40.39 24.13,46.99 29.53,46.99 IC1.32
ACBUS8  (via drill 0.5 pad 1.02)
  Top 0.254: U$1.32 17.03,40.84 23.18,46.99 | 23.18,46.99 23.81,47.62 29.6,47.62 IC1.31 | v22.86,47.31 23.18,46.99
  Bottom 0.254: 18.1,48.58 19.37,47.31 v22.86,47.31
  Bottom 0.61: LED1.2 18.1,48.58
ACBUS9  (via drill 0.5 pad 1.02)
  Top 0.254: U$1.33 16.53,41.3 21.91,46.67 21.91,47.62 22.54,48.26 | IC1.30 29.67,48.26 22.54,48.26 | v20.32,48.58 20.64,48.26 22.54,48.26
  Bottom 0.61: LED2.2 v20.32,48.58
ADBUS0
  Top 0.254: U$1.13 30.37,27.73 31.43,26.67 36.56,26.67 IC1.65
ADBUS1
  Top 0.254: U$1.14 30.82,28.23 31.75,27.3 36.48,27.3 IC1.64
ADBUS2
  Top 0.254: U$1.15 31.28,28.73 32.07,27.94 34.29,27.94 IC1.60
ADBUS3
  Top 0.254: U$1.16 31.73,29.23 32.38,28.57 34.22,28.57 IC1.59
ADBUS4
  Top 0.254: IC1.54 31.84,29.73 U$1.17
ADBUS5
  Top 0.254: IC1.53 31.63,30.23 U$1.18
ADBUS6
  Top 0.254: IC1.52 31.43,30.73 U$1.19
ADBUS7
  Top 0.254: IC1.51 31.22,31.23 U$1.20
ADC1_CLK
  Top 0.305: IC1.113 57.25,45.24 57.94,45.24 60.64,47.94 64.77,47.94 67.63,50.8 67.63,53.98 68.26,54.61 70.55,54.61 U$6.10
ADC1_D0
  Top 0.305: IC1.114 57.02,45.72 57.47,45.72 60.64,48.9 60.96,48.9 61.03,48.83 U$6.20
ADC1_D1
  Top 0.305: IC1.115 56.79,46.2 57.15,46.2 60.43,49.48 U$6.19
ADC1_D2
  Top 0.305: IC1.119 57.93,50.16 58.42,50.16 59.37,51.12 60.01,51.12 60.64,50.48 61.59,50.48 61.91,50.16 63.33,50.16 U$6.18
ADC1_D3
  Top 0.305: IC1.120 57.86,50.8 58.42,50.8 59.37,51.75 61.28,51.75 62.23,50.8 63.34,50.8 U$6.17
ADC1_D4
  Top 0.305: IC1.125 55.28,51.75 56.83,51.75 57.78,52.7 62.55,52.7 arc-90 62.57,52.73 U$6.14
ADC1_D5
  Top 0.305: IC1.126 55.2,52.39 56.83,52.39 57.78,53.34 62.55,53.34 arc-90 62.59,53.38 U$6.13
ADC1_D6
  Top 0.305: IC1.127 55.13,53.02 56.83,53.02 57.78,53.98 62.55,53.98 arc-90 62.6,54.03 U$6.12
ADC1_D7
  Top 0.305: IC1.128 55.06,53.66 56.83,53.66 57.78,54.61 62.55,54.61 arc-90 62.62,54.68 U$6.11
ADC2_CLK
  Top 0.305: IC1.112 57.48,44.77 58.42,44.77 59.69,46.04 67.94,46.04 72.71,41.27 74.36,41.27 U$2.10
ADC2_D0
  Top 0.305: IC1.98 58.03,33.34 63.5,33.34 65.66,35.49 U$2.20
ADC2_D1
  Top 0.305: IC1.99 58.1,33.97 63.18,33.97 65.35,36.14 U$2.19
ADC2_D2
  Top 0.305: IC1.100 58.17,34.61 63.18,34.61 65.37,36.79 U$2.18
ADC2_D3
  Top 0.305: IC1.101 58.25,35.24 62.87,35.24 65.06,37.44 U$2.17
ADC2_D4
  Top 0.305: IC1.103 59.03,35.88 62.55,35.88 66.06,39.39 U$2.14
ADC2_D5
  Top 0.305: IC1.104 59.1,36.51 62.23,36.51 65.76,40.04 U$2.13
ADC2_D6
  Top 0.305: IC1.105 59.17,37.15 61.91,37.15 65.46,40.69 U$2.12
ADC2_D7
  Top 0.305: IC1.106 59.24,37.78 61.59,37.78 65.16,41.34 U$2.11
ADC_GND  (via drill 0.5 pad 1.02)
  Top 0.305: v68.9,53.66 69.27,54.03 U$6.9 71.49,54.03 72.39,54.93 v72.39,55.24 | v68.9,51.12 69.22,50.8 70.59,50.8 U$6.4 | C50.2 v74.61,46.04
  Top 0.406: v77.15,42.55 75.3,40.69 U$2.9 72.76,40.69 v72.39,40.32 | 72.71,37.78 v72.39,38.1 73.05,37.44 U$2.4 | X3.2 X3.3 87.94,41.6 90.17,39.37 R30.2 90.48,38.42 | 90.48,38.42 90.17,38.1 | 90.48,38.42 88.57,36.5 X3.4 X3.5
  Top 1.016: v74.61,53.98 75.58,54.94 X2.3 X2.4 84.76,54.94 v85.41,54.29 v87.31,52.39 | v74.61,50.48 75.26,49.84 X2.2 X2.5 84.76,49.84 v85.41,50.48 v87.31,52.39 | R19.2 v87.31,52.39 | U$8.NET1 92.08,49.85 v91.76,50.16 | v93.03,48.9 v91.76,48.9 | C57.2 v78.42,32.7 | R30.2 v92.07,39.05 v92.08,39.05 | v90.49,40.64 90.49,39.05 R30.2 | v90.49,37.15 90.49,37.78 90.48,38.42 | v77.15,42.55 77.15,43.5 v74.61,46.04
  Bottom 0.305: v68.9,53.66 v68.9,51.12
  Bottom 0.406: C56.2 v68.9,51.12 | C55.2 69.85,53.66 v68.9,53.66 | C60.2 73.34,37.15 v72.39,38.1 v72.39,40.32 C61.2
  Bottom 1.016: v74.61,46.04 v74.61,50.48 73.34,51.75 69.53,51.75 v68.9,51.12 | v87.31,52.39 89.53,52.39 v91.76,50.16 | v91.76,48.9 86.04,48.9 84.14,46.99 75.56,46.99 v74.61,46.04 | v77.15,42.55 80.01,42.55 X3.2 85.72,41.6 85.72,41.59 | v83.5,36.51 X3.4 | v83.5,36.51 X3.5 80.01,37.45 80.01,38.1 v72.39,38.1 | v83.5,36.51 83.5,34.92 81.28,32.7 v78.42,32.7
  other vias: 79.06,54.93 79.06,49.85 72.39,58.42 75.25,58.42 78.11,58.42 80.96,58.42 83.82,58.42 86.68,58.42 89.22,58.42 92.08,58.42 92.08,56.52 92.08,54.61 83.5,41.59 91.76,47.62 93.03,47.62 91.76,46.35 93.03,46.35 87.63,48.26 87.63,46.99 87.63,45.72 85.72,46.04 84.14,46.04 82.55,46.04 80.96,46.04 79.38,46.04 77.79,46.04 76.2,46.04 74.93,33.02 74.93,30.48 78.11,30.48 81.28,30.48 84.45,30.48 87.63,30.48 90.81,30.48 93.98,30.48 97.16,30.48 97.16,32.38 97.16,35.56 97.16,38.73 97.16,41.91 95.25,41.91 93.34,41.91
  pour Bottom: 93.34,59.05 71.75,59.05 71.75,53.98 68.58,53.98 68.58,49.53 71.75,49.53 71.75,43.81 93.34,43.81
  pour Top: 71.75,59.05 71.75,53.98 68.58,53.98 68.58,49.53 71.75,49.53 71.75,44.13 93.34,44.13 93.34,59.05
  pour Bottom: 73.66,43.81 73.66,42.55 75.56,42.55 75.56,40.64 71.75,40.64 71.75,36.2 75.56,36.2 75.56,34.29 73.66,34.29 73.66,29.21 98.42,29.21 98.42,43.81
  pour Top: 73.66,43.81 73.66,42.55 75.56,42.55 75.56,40.64 71.75,40.64 71.75,36.2 75.56,36.2 75.56,34.29 73.66,34.29 73.66,29.21 98.42,29.21 98.42,43.81
ASDI
  Top 0.305: CONFIG_FLASH.5 34,61.46 34.63,62.1 38.44,62.1 38.76,61.78 38.76,59.56 39.4,58.92 39.4,55.51 IC1.6
DATA
  Top 0.305: R12.1 33.05,60.51 33.05,57.76 35.56,55.24 35.56,54.39 IC1.13
DCLK
  Top 0.305: IC1.12 37.15,53.51 37.15,54.29 36.2,55.24 36.2,55.56 35.24,56.52 35.24,56.83 35.27,56.86 CONFIG_FLASH.6
FPGA_CLK
  Top 0.305: IC1.91 52.57,33.85 52.57,33.05 56.16,29.45 56.16,29 56.84,28.33 57.28,28.33 58.69,26.93 OSCILLATOR50_MHZ.3
GND  (via drill 0.5 pad 0.3, 0.5 pad 0.61, 0.5 pad 1.02, 0.6 pad 1.68, 0.6 pad 6.45)
  Top 0.254: 20.48,32.23 20.98,32.73 U$1.23 22.89,32.73 23.5,33.34 23.5,34.29 v23.81,34.61 | 20.48,32.23 18.73,30.48 v17.78,30.48 | U$1.22 20.48,32.23 | v17.78,30.48 17.46,30.8 17.46,31.43 15.53,33.37 U$1.35 U$1.36 14.8,34.73 C14.2 | U$1.9 U$1.10 U$1.11 20.03,25.37 20.32,25.08 20.95,25.08 21.27,24.77 C10.2 | U$1.4 16.53,27.32 17.78,28.57 v17.78,30.48 | U$1.41 U$1.42 10.23,30.73 9.53,31.43 C5.2 8.89,33.02 C4.2 | U$1.48 14.5,27.73 14.5,28.09 14.36,28.23 U$1.47 6.64,28.23 v6.35,27.94 6.56,27.73 U$1.48
  Top 0.305: 45.39,35.29 45.39,34.67 IC1.82 49.58,30.48 50.16,30.48 52.7,27.94 v52.7,26.99 | IC1.63 44.71,36.24 44.71,36.41 | 41.32,37.09 | 37.53,39.56 37.42,39.56 IC1.48 33.97,36.11 33.97,35.56 32.38,33.97 v27.94,33.97 | IC1.41 34.05,41.13 34.16,41.13 | IC1.27 34.44,45.62 35.06,45.62 36.18,44.49 36.18,44.12 35.24,43.18 32.38,43.18 32.07,42.86 31.75,42.86 31.43,42.55 31.15,42.55 IC1.36 | 37.98,46.29 37.98,46.32 IC1.21 35.4,48.9 34.29,48.9 32.38,50.8 v32.07,50.8 | IC1.19 38.65,47.06 38.65,46.97 | 45.16,52.13 45.16,52.24 IC1.140 47.62,54.71 47.62,55.24 50.48,58.1 v51.44,58.1 | IC1.131 47.86,48.58 47.86,48.54 | 52.8,44.49 52.97,44.49 52.97,45.03 53.66,45.72 54.19,45.72 IC1.118 56.42,47.94 57.47,47.94 v59.69,50.16 | 51,46.29 51.23,46.29 IC1.123 53.66,48.72 53.66,49.21 54.29,49.85 54.93,49.85 55.24,49.53 55.88,49.53 v58.1,51.75 | IC1.95 51.77,37.48 | 51.77,37.48 51.22,38.02 51.22,38.43 | JTAG.10 v29.26,56.83 | R16.2 18.78,67.09 18.14,67.09 17.51,66.46 17.51,61.38 18.78,60.11 JTAG.2 19.09,57.25 v18.78,56.93 | 41.32,37.09 IC1.57 37.15,32.92 37.15,32.38 36.2,31.43 35.24,31.43 33.34,29.53 v33.02,29.53 | 41.32,37.09 41.34,37.09 | U$6.16 64.46,51.43 v65.41,50.48 | 95.25,49.85 U$8.NET2 | U$6.1 68.51,48.83 67.31,47.62 v67.31,47.31 | IC1.108 57.48,40.96 54.29,40.96 51.77,38.43 51.77,37.48 | 59.39,28.89 OSCILLATOR50_MHZ.2 59.62,29.43 C49.2 59.09,28.89 v58.1,28.89 | U$2.16 69.86,38.09 v71.44,36.51 | v71.44,36.51 71.44,41.59 67.63,45.4 61.91,45.4 v61.59,45.09 | U$2.1 72.46,35.49 v71.44,36.51 | U$7.12 49.53,7.3 47.94,5.71 47.94,2.22 v49.21,0.95 | U$7.30 72.39,1.59 v73.03,0.95
  Top 0.406: v42.47,41.8 41.57,40.9 | v44.26,40.01 43.37,39.11 | v46.06,41.8 46.96,40.9 | v43.37,40.9 45.16,39.11 | v44.26,43.6 v45.16,42.7 | CONFIG_FLASH.4 32.77,65.33 v32.7,65.41 | C62.2 85.75,72.39 IC2.3 | v99.06,51.12 97.15,51.12 C53.2 | v78.42,79.06 82.55,79.06 82.55,79.69
  Top 0.61: 23.5,21.91 v23.5,24.77 21.91,24.77 C10.2 | C9.2 23.5,21.91 | 26.67,12.06 v26.35,11.75 | 23.5,21.91 v26.04,19.37 | v65.09,62.87 65.09,66.67 64.45,67.31 v62.87,67.31 | v56.52,54.61 55.56,55.56 v54.29,55.56 | v57.47,55.56 56.52,56.52 v55.24,56.52 | v58.42,56.52 57.47,57.47 v56.2,57.47 | 10.79,61.28 10.16,60.64 v9.21,60.64 7.94,61.91 v0.95,61.91 | 0.32,0.32 0.32,79.69 82.55,79.69 99.69,79.69 99.69,0.32 0.32,0.32
  Top 0.813: v11.75,36.51 12.38,36.51 12.7,36.2 C14.2 | U$3.5 13.65,48.26 15.24,46.67 v15.24,44.77 C15.2
  Top 1.016: D2.1 23.01,10.79 25.72,10.79 26.35,10.16 v26.35,5.4 24.77,3.81 21.27,3.81 15.89,9.19 X1.4 15.75,9.84 12.06,9.84 8.26,13.65 8.26,15.56 8.89,16.19 D1.1 | v6.35,27.94 4.76,26.36 C2.2 C3.2 4.76,18.41 6.99,16.19 D1.1 | D1.1 12.87,17.95 R1.1 | v44.26,60.66 44.26,53.48 | v44.26,22.94 44.26,30.58 | v61.59,45.09 60.65,44.14 C36.2 61.59,43.82 v62.87,42.55 62.52,42.55 C39.2 | v44.26,60.66 44.13,60.79 44.13,61.59 46.35,63.82 v46.35,67.63 v45.09,67.63 45.09,64.45 43.18,62.55 43.18,59.95 v43.37,59.76 | v66.04,65.41 67.63,63.82 v68.26,63.82 | v66.99,66.36 67.94,65.41 68.9,65.41 69.22,65.09 v69.22,64.77 v70.17,65.72 | v81.92,66.04 v85.72,66.04 | v81.92,64.77 v85.72,64.77 | v81.92,63.5 v85.72,63.5 | 95.25,49.85 96.52,49.85 97.15,50.48 C53.2 C52.2 v97.15,56.2 v97.16,56.2 | C38.2 25.72,40.77 v25.72,39.69 26.35,39.05 27.3,39.05 27.88,39.62 C37.2 | D4.2 10.48,61.59 10.79,61.28 11.96,60.11 JTAG.2 | v51.44,67.31 56.83,67.31 v57.15,67.63 | v51.44,67.31 54.29,67.31 v55.88,65.72 | v51.44,67.31 47.94,67.31 v47.62,67.63 47.62,63.18 45.4,60.96 45.4,60 v45.16,59.76 v44.26,60.66 | v50.48,64.14 50.48,66.36 v51.44,67.31 | v56.2,57.47 v54.29,55.56 | v99.06,65.41 v99.06,58.42 v99.06,54.93 v99.06,51.12 v99.06,47.31 v99.06,43.5 99.06,6.35 93.66,0.95 v8.89,0.95 4.76,0.95 0.95,4.76 v0.95,7.62 v0.95,72.71 0.64,73.03 0.64,74.93 4.76,79.06 v40.32,79.06 v45.72,79.06 v50.48,79.06 v55.24,79.06 v61.59,79.06 v68.26,79.06 v73.66,79.06 v78.42,79.06 v82.23,79.06 | v99.06,65.41 v99.06,73.03 | v99.06,73.03 99.06,77.47 97.79,78.74 arc90 97.47,79.06 v86.36,79.06 | v99.06,73.03 98.18,72.15 S1.4 S1.3 94.26,65.41 v99.06,65.41
  Top 1.27: v7.94,32.38 C5.2 | 24.13,34.92 v23.81,34.61
  Bottom 0.305: R25.1 R23.1 60.3,31.75 57.78,31.75 56.4,31.75 56.08,32.07 C32.2 | R21.1 59.03,27.3 58.1,27.3 | C31.2 52.34,26.99 v52.7,26.99 53.02,26.67 57.47,26.67 58.1,27.3 | C54.2 65.72,50.8 v65.41,50.48 65.41,48.9 v61.59,45.09 | v32.07,50.8 31.71,50.8 | v58.1,28.89 58.1,27.3 | v71.44,36.51 C59.2 | 43.37,23.31 43.73,22.94 v44.26,22.94 46.04,21.17 46.04,20 | v36.83,18.41 38.1,19.68 45.09,19.68 v45.4,20 46.04,20 | 46.04,20 48.26,22.23 51.75,22.23 v52.07,21.91 | v53.02,20 48.9,20 v47.62,18.73 47.31,18.73 46.35,17.78 40.64,17.78 v39.69,16.83 | v72.39,61.91 69.53,64.77 v69.22,64.77 | v75.56,65.09 76.83,66.36 76.83,67.94
  Bottom 0.406: v32.7,65.41 32.07,64.77 32.07,59.64 v29.26,56.83 | v99.06,61.59 97.16,61.59 | v99.06,12.38 90.17,12.38 v90.17,13.97 | 99.69,8.89 v99.06,8.89
  Bottom 0.61: C6.2 17.46,31.11 17.46,30.8 v17.78,30.48 18.73,29.53 20.64,29.53 21.27,28.89 C13.2 | v23.81,34.61 25.4,33.02 | 25.4,33.02 26.67,31.75 26.67,23.18 | 26.67,23.18 26.67,19.05 | 26.67,19.05 26.67,12.06 v26.35,11.75 | v26.04,19.37 26.35,19.37 26.67,19.05 | 49.43,46.97 59.69,57.23 59.69,59.37 63.18,62.87 v65.09,62.87 | 28.26,36.2 25.4,33.34 25.4,33.02 | v54.29,55.56 53.24,54.51 C24.2 | v58.1,28.89 58.1,29.84 57.78,30.16 57.78,31.75 | 30.8,79.69 0.32,79.69 0.32,0.32 99.69,0.32 99.69,8.89 99.69,79.69 37.47,79.69 | 30.8,79.69 32.7,79.69 | 32.7,79.69 34.92,79.69 | 34.92,79.69 37.47,79.69 | v43.37,23.52 43.37,23.31 39.69,26.99 39.37,26.99 33.34,20.95 33.34,13.65 27.3,7.62 26.35,7.62 v26.35,5.4 | 44.03,23.18 v44.26,22.94 | v33.34,24.77 33.02,24.77 v31.11,22.86 | v31.11,22.86 30.16,21.91 v30.16,15.24 | v31.11,22.86 26.99,22.86 26.67,23.18 | LED_3.2 32.7,79.69 | LED_2.2 34.92,79.69 | LED_1.2 37.15,79.38 37.47,79.69 | LED_4.2 30.48,79.38 30.8,79.69
  Bottom 1.016: C8.2 C7.2 | C1.2 C6.2 | v18.78,56.93 15.24,53.4 v15.24,44.77 | C25.2 31.71,50.8 C35.2 30.13,56.83 v29.26,56.83 | C28.2 33.02,29.66 v33.02,29.53 | C29.2 C28.2 | C28.2 C27.2 C26.2 | v27.94,33.97 28.26,34.29 28.26,36.2 | v61.59,45.09 61.59,46.02 C33.2 C34.2 57.06,50.71 v58.1,51.75 | LED_4.2 LED_3.2 LED_2.2 LED_1.2 | C41.2 C40.2 v46.35,67.63 | C46.2 C47.2 63.82,68.26 v62.87,67.31 63.02,67.15 64.61,67.15 66.04,65.72 v66.04,65.41 | C24.2 C30.2 51.44,57.95 v51.44,58.1 53.02,56.52 v55.24,56.52 | v59.69,50.16 58.74,49.21 | C54.2 66.67,47.94 v67.31,47.31 | v25.72,39.69 23.18,37.15 22.54,37.15 | v71.44,36.51 71.44,28.89 67.94,25.4 60.96,25.4 59.69,24.13 46.35,24.13 45.19,23.5 v45.16,23.52 | LS.1 55.65,67.72 C42.2 | C42.2 55.56,66.04 v55.88,65.72 | C42.2 v57.15,67.63 | v70.17,65.72 70.8,66.36 C48.2 70.89,67.72 U$5.1 70.89,68.03 70.8,67.94 76.83,67.94 76.83,69.22 C44.2 C43.2 78.74,69.22 v81.92,66.04 | v69.22,64.77 v68.26,63.82 | U$4.1 85.81,67.72 C45.2 v85.72,66.04 v85.72,64.77 v85.72,63.5 86.68,62.55 97.16,62.55 97.16,61.59 v97.16,56.2 | v56.2,57.47 v55.24,56.52 | v55.24,56.52 v54.29,55.56 | v0.95,54.93 0.95,75.25 4.76,79.06 v8.26,79.06 v24.77,79.06 | v28.89,79.06 v82.23,79.06 | v86.36,79.06 93.03,79.06 v99.06,73.03 v99.06,61.59 v99.06,43.5 v99.06,40.01 v99.06,36.2 v99.06,32.7 v99.06,29.21 v99.06,25.08 v99.06,21.27 v99.06,18.41 v99.06,15.56 v99.06,12.38 v99.06,8.89 99.06,5.4 v96.84,3.17 94.61,0.95 v91.44,0.95 5.4,0.95 v3.49,2.86 0.95,5.4 v0.95,10.48 | v0.95,13.34 v0.95,10.48 | v0.95,10.48 v0.95,7.62
  Bottom 1.27: C11.2 13.65,26.68 C7.2 | v7.94,32.38 7.3,32.38 6.35,31.43 v6.35,27.94 8.57,27.94 9.21,27.3 12.06,27.3 12.38,26.99 C11.2 | C1.2 22.23,34.29 | 22.23,34.29 23.5,34.29 v23.81,34.61 23.81,35.88 22.54,37.15 15.24,44.45 v15.24,44.77 | C12.2 21.91,33.97 22.23,34.29
  other vias: 3.17,77.15 96.84,77.15 44.26,41.8 43.37,42.7 45.16,40.9 38.64,45.32 39.53,46.21 40.43,47.11 48.68,46.79 49.58,45.9 50.47,45 87.63,0.95 83.19,0.95 78.11,0.95 67.94,0.95 62.87,0.95 58.42,0.95 53.98,0.95 53.98,0.95 44.45,0.95 39.37,0.95 33.97,0.95 28.89,0.95 23.81,0.95 17.46,0.95 0.95,58.42 0.95,65.41 0.95,68.9 11.43,79.06 14.29,79.06 17.46,79.06 21.27,79.06 31.75,79.06 35.88,79.06 89.85,79.06 99.06,69.22 69.85,31.11 50.16,15.24 40.01,73.03 23.5,73.03
  pour Top: 31.69,41.8 44.26,29.23 56.84,41.8 44.26,54.37
  pour Bottom: 33.49,41.8 44.26,31.02 55.04,41.8 51.9,44.94 51.22,48.31 48.53,48.31 44.26,52.58
  pour Top: 0,80.01 0,0 100.33,0 100.33,27.94 72.39,27.94 72.39,34.92 70.48,34.92 70.48,48.26 67.31,48.26 67.31,55.24 70.48,55.24 70.48,60.33 100.33,60.33 100.33,80.01
  pour Bottom: 0,80.01 0,0 100.33,0 100.33,27.94 72.39,27.94 72.39,34.92 70.48,34.92 70.48,48.26 67.31,48.26 67.31,55.24 70.48,55.24 70.48,60.33 100.33,60.33 100.33,80.01 88.9,80.01 88.9,71.75 42.55,71.75 42.55,80.01
GPIO1_CLKIN0  (via drill 0.5 pad 0.3)
  Top 0.305: IC1.88 57.15,27.15 v57.15,20.95 | v36.51,16.51 36.51,12.06 U$7.1
  Bottom 0.305: v57.15,20.95 48.26,20.95 46.04,18.73 40.01,18.73 v36.51,16.51
GPIO1_CLKOUT0
  Top 0.305: IC1.85 54.61,27.57 54.61,20 59.69,14.92 U$7.19
GPIO1_CLKOUT1
  Top 0.305: IC1.87 55.88,27.71 55.88,20.64 62.23,14.29 U$7.21
GPIO1_D0
  Top 0.305: IC1.66 38.1,27.5 38.1,10.79 36.83,9.53 U$7.2
GPIO1_D1
  Top 0.305: U$7.4 39.37,9.53 40.64,10.79 40.64,18.73 38.73,20.64 38.73,27.43 IC1.67
GPIO1_D2
  Top 0.305: IC1.68 39.37,27.36 39.37,20.95 41.91,18.41 U$7.5
GPIO1_D3
  Top 0.305: IC1.69 40.01,27.29 40.01,21.27 42.55,18.73 42.55,17.14 43.18,16.51 43.18,11.11 41.91,9.84 U$7.6
GPIO1_D4
  Top 0.305: IC1.70 40.64,27.22 40.64,21.59 43.18,19.05 43.18,17.78 44.45,16.51 U$7.7
GPIO1_D5
  Top 0.305: IC1.71 41.27,27.14 41.27,21.91 43.81,19.37 43.81,18.1 45.72,16.19 45.72,10.79 44.45,9.53 U$7.8
GPIO1_D6
  Top 0.305: IC1.72 41.91,27.07 41.91,22.23 44.45,19.68 44.45,18.73 46.99,16.19 U$7.9
GPIO1_D7
  Top 0.305: IC1.73 46.67,27.02 46.67,18.1 48.26,16.51 48.26,10.79 46.99,9.53 U$7.10
GPIO1_D8
  Top 0.305: IC1.74 47.31,27.09 47.31,20.64 52.07,15.88 U$7.13
GPIO1_D9
  Top 0.305: IC1.75 47.94,27.16 47.94,20.95 53.34,15.56 53.34,10.79 52.07,9.53 U$7.14
GPIO1_D10
  Top 0.305: IC1.76 48.58,27.23 48.58,21.27 54.61,15.24 U$7.15
GPIO1_D11
  Top 0.305: IC1.77 49.21,27.31 49.21,21.59 55.88,14.92 55.88,10.79 54.61,9.53 U$7.16
GPIO1_D12
  Top 0.305: IC1.79 48.26,29.67 48.26,29.21 49.85,27.62 49.85,21.91 57.15,14.61 U$7.17
GPIO1_D13
  Top 0.305: IC1.84 53.98,27.49 53.98,19.68 58.42,15.24 58.42,10.79 57.15,9.53 U$7.18
GPIO1_D14
  Top 0.305: IC1.86 55.24,27.64 55.24,20.32 60.96,14.61 60.96,10.79 59.69,9.53 U$7.20
LED1  (via drill 0.5 pad 1.02)
  Top 0.305: v37.15,69.85 37.15,69.53 37.78,68.9 40.01,68.9 41.91,66.99 41.91,56.53 IC1.1
  Bottom 1.016: R26.2 v37.15,69.85
LED2  (via drill 0.5 pad 1.02)
  Top 0.305: IC1.2 41.27,56.46 41.27,66.67 39.69,68.26 37.15,68.26 35.56,69.85 v34.92,69.85
  Bottom 1.016: R27.2 v34.92,69.85
LED3  (via drill 0.5 pad 1.02)
  Top 0.305: IC1.3 40.64,56.38 40.64,66.36 39.37,67.63 36.83,67.63 35.88,68.58 34.61,68.58 33.66,69.53 33.02,69.53 v32.7,69.85
  Bottom 1.016: R28.2 v32.7,69.85
LED4  (via drill 0.5 pad 1.02)
  Top 0.305: IC1.4 40.01,56.31 40.01,66.04 39.05,66.99 36.2,66.99 35.24,67.94 33.97,67.94 33.34,68.58 31.75,68.58 v30.48,69.85
  Bottom 1.016: R29.2 v30.48,69.85
MSEL0  (via drill 0.5 pad 1.02)
  Top 0.305: IC1.94 53.7,34.84 54.37,34.84 55.27,33.94 55.27,32.6 57.7,30.16 58.74,30.16 58.97,30.39 v58.97,30.8
  Bottom 0.305: 64.77,29.84 63.81,30.8 v58.97,30.8 | 64.77,29.84 64.68,29.76 R21.2 | R20.1 65.84,29.84 64.77,29.84
MSEL1  (via drill 0.5 pad 1.02)
  Top 0.305: IC1.96 57.89,32.07 v64.77,32.07
  Bottom 0.305: R22.1 65.17,32.93 64.77,32.53 | R23.2 64.37,32.93 64.77,32.53 | 64.77,32.53 v64.77,32.07
MSEL2  (via drill 0.5 pad 1.02)
  Top 0.305: IC1.97 57.96,32.7 64.14,32.7 v66.04,34.61
  Bottom 0.305: R24.1 65.93,35.77 66.04,35.65 v66.04,34.61 64.88,34.61 R25.2
N$1
  Top 0.254: U$1.8 18.53,24.97 C10.1 C9.1 L1.2
N$2
  Top 0.305: R12.2 34.63,63.05 34.95,63.37 35.9,63.37 36.54,64 CONFIG_FLASH.2
N$3  (via drill 0.6 pad 1.68)
  Top 0.254: U$1.37 13.12,33.23 13.02,33.34 v13.02,34.29
  Bottom 0.254: v13.02,34.29 C1.1
N$4
  Top 0.254: U$1.5 17.03,21.79 16.51,21.27 R1.2
N$5  (via drill 0.6 pad 1.68)
  Top 0.254: U$1.38 14.89,32.73 15.88,31.75 v15.88,30.48
  Bottom 0.254: C6.1 14.29,32.06 v15.88,30.48
N$6
  Top 0.254: C2.1 Q1.1 10.48,25.72 14.92,25.72 15.03,25.82 U$1.1
N$7
  Top 0.254: C3.1 Q1.2 10.79,20.32 13.65,23.18 13.65,23.5 15.53,25.37 U$1.2
N$8
  Top 0.254: U$1.34 16.03,36.04 15.88,36.2 C14.1 R2.1
N$9
  Top 0.254: U$1.7 18.03,17.85 R4.1
N$10  (via drill 0.5 pad 1.02)
  Top 0.305: IC1.9 36.18,56.6 v36.18,57.07
  Bottom 0.305: v36.18,57.07 R13.1
N$11
  Top 0.254: X1.2 18.39,13.36 16.83,14.92 15.39,14.92 D1.3 16.51,16.68 R3.2
N$12
  Top 0.254: U$1.6 17.53,20.39 R3.1
N$13  (via drill 0.6 pad 1.68)
  Top 0.254: U$1.3 16.03,23.97 v15.56,23.5
  Bottom 0.254: C7.1 15.55,23.18 | C7.1 v15.55,23.49 v15.56,23.5 | C7.1 C8.1 L2.2
N$14
  Top 0.254: R4.2 20.81,16.97 D2.3 18.75,9.7 X1.3
N$15  (via drill 0.5 pad 1.02)
  Top 0.305: IC1.14 34.39,54.86 v34.07,55.27
  Bottom 0.305: v34.07,55.27 34.84,55.27 R14.1
N$16  (via drill 0.5 pad 1.02)
  Top 0.305: IC1.92 53.02,34.11 53.02,33.49 v57.06,29.45
  Bottom 0.305: v57.06,29.45 56.84,29.23 55.94,30.13 55.04,30.13 54.81,30.35 R15.1
N$17
  Bottom 1.016: L3.2 C40.1 C41.1 50.48,71.44 51.12,70.8 51.12,70.02 LS.3
N$18
  Bottom 1.016: L4.2 C44.1 C43.1 79.68,71.44 U$4.3
N$19
  Bottom 1.016: L5.2 C46.1 C47.1 65.41,71.44 66.36,70.48 66.36,70.02 U$5.3
N$20
  Top 1.016: EXT_5V.1 D3.2
N$21
  Top 1.016: D4.1 EXT_5V.2
N$22
  Top 1.016: D5.1 POWER_SELECT.3
N$23
  Top 0.305: OSCILLATOR50_MHZ.4 OSCILLATOR50_MHZ.1 62.53,30.06 C49.1
  Top 1.016: L6.2 OSCILLATOR50_MHZ.1
N$24
  Top 0.305: U$6.7 71.73,52.73 72.39,52.07 U$6.6
  Top 0.406: C51.2 72.39,52.07
N$25
  Top 0.305: U$6.2 72.44,49.48 | 72.44,49.48 73.03,48.9 C50.1 | U$6.3 71.79,50.13 72.44,49.48
N$26
  Top 1.016: C51.1 X2.1 R19.1
N$27
  Top 0.406: U$2.7 76.5,39.39 C58.2 76.53,38.74 U$2.6
N$28
  Top 0.254: U$1.45 6.01,29.23 3.49,31.75 3.49,33.66 2.86,34.29 2.86,38.42 3.17,38.73 R6.1 4.13,40.01 U$3.1 5.4,40.64 5.71,40.32
N$29
  Top 0.254: 6.67,41.91 5.4,43.18 U$3.2 | U$1.44 6.78,29.73 5.4,31.11 5.4,35.24 6.67,36.51 6.67,41.91 | R7.1 6.98,42.23 6.67,41.91
N$30
  Top 0.254: U$1.43 7.55,30.23 6.35,31.43 6.35,34.92 9.84,38.42 9.84,43.18 8.57,44.45 | R5.2 9.52,45.4 8.57,44.45 | 8.57,44.45 6.03,44.45 U$3.3
N$31
  Top 0.254: U$3.4 5.71,47.31 6.03,47.31 6.19,47.15 | R5.1 6.99,46.35 6.19,47.15 | R8.1 6.19,47.15
N$32
  Top 0.406: U$2.3 75.28,36.79 75.94,36.14 | 75.94,36.14 76.83,35.24 C57.1 | U$2.2 75.94,36.14
N$33
  Top 1.016: R30.1 X3.1 C58.1
N$34
  Bottom 1.016: LED_1.1 R26.1
N$37
  Bottom 1.016: LED_2.1 R27.1
N$38
  Bottom 0.61: R9.1 25.08,53.02 23.81,54.61 19.37,54.61 18.1,53.02 LED1.1
N$39
  Bottom 0.61: R10.1 LED2.1
N$40
  Bottom 1.016: LED_3.1 R28.1
N$41
  Top 0.254: U$1.28 19.03,36.81 21.59,39.37 21.91,39.37 R11.1
N$42
  Bottom 1.016: LED_4.1 R29.1
N$44
  Top 0.406: R33.1 IC2.4
N$49
  Top 0.406: C62.1 88.27,70.48 89.5,71.72 S1.2 S1.1 | C62.1 87.31,70.49 86.68,71.12 IC2.2 | R31.1 C62.1
NCS  (via drill 0.5 pad 1.02)
  Top 0.305: v37.17,58.29 37.17,57.15 37.17,56.32 IC1.8 | v38.76,65.91 38.38,65.91 CONFIG_FLASH.1
  Bottom 0.305: v37.17,58.29 37.17,64.32 v38.76,65.91
PB0
  Top 0.305: IC1.133 53.02,55.16 53.02,55.88 55.56,58.42 66.04,58.42 78.74,71.12 R33.2
TCK
  Top 0.305: R16.1 JTAG.1 19.09,63.92 20.68,65.51 27.35,65.51 27.98,64.87 27.98,56.3 27.98,56.15 28.89,55.24 30.16,55.24 31.11,54.29 32.67,54.29 35.06,51.9 35.96,51.9 35.96,51.88 IC1.16
TDI
  Top 0.305: JTAG.9 30.52,61.38 30.52,57.34 35.28,52.58 35.96,52.58 IC1.15
  Top 0.406: JTAG.9 R18.1 | R18.1
TDO
  Top 0.305: IC1.20 35.57,49.43 35.47,49.53 34.61,49.53 31.75,52.39 29.84,52.39 28.89,53.34 27.94,53.34 26.89,54.39 26.08,54.39 21,54.39 20.05,55.35 20.05,56.93 20.36,57.25 20.36,61.38 JTAG.3
TMS
  Top 0.305: IC1.18 36.31,50.11 36.25,50.16 34.92,50.16 31.75,53.34 30.48,53.34 29.53,54.29 28.57,54.29 25.37,57.5 25.05,57.5 | JTAG.5 25.45,61.38 25.45,57.89 25.05,57.5 | R17.1 24.17,56.61 25.05,57.5
USB_CLK  (via drill 0.5 pad 1.02)
  Top 0.254: U$1.29 18.53,38.85 v23.81,44.13 | IC1.25 33.97,47.5 33.97,48.26 33.02,49.21 v28.57,49.21
  Bottom 0.254: v28.57,49.21 23.81,44.45 v23.81,44.13

## Text on the board
Top: Can you read this? | Rotate the FPGA | Power | Designed by / D.P. Rev 1 / SA5PEL / DO2PL | Analog Block | Parts which are on the bottom need to be mirrored!!!
tDocu: Connect GND here / in some way | Connect GND here / in some way